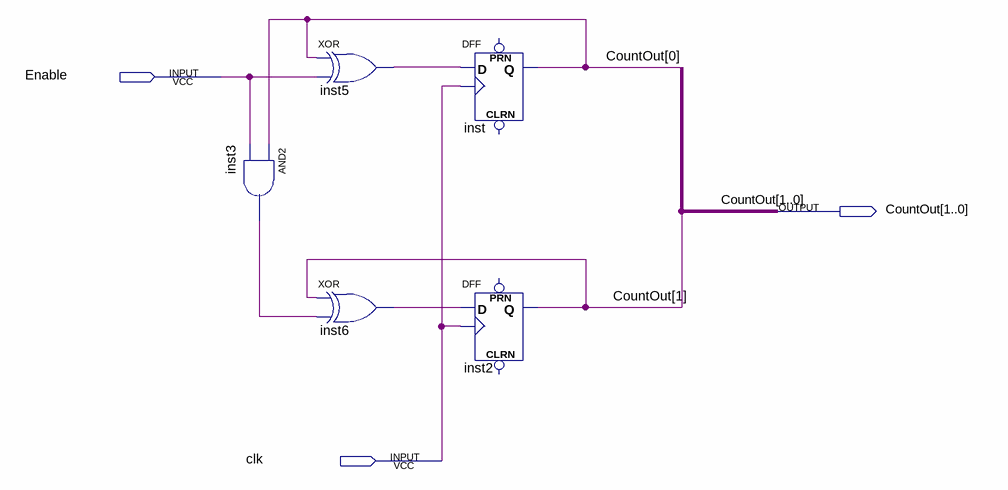
[diagram p0: schematic sheet]
// Quartus schematic TwoBitCount.bdf as structural Verilog: 5 symbols, 3 pins
module TwoBitCount (
  input  Enable,
  input  clk,
  output [1:0] CountOut
);

  wire inst3_out, inst5_out, inst6_out;

  and inst3 (inst3_out, CountOut[0], Enable);
  xor inst5 (inst5_out, CountOut[0], Enable);
  xor inst6 (inst6_out, CountOut[1], inst3_out);
  DFF inst (.CLK(clk), .D(inst5_out), .Q(CountOut[0]));  // open: CLRN, PRN
  DFF inst2 (.CLK(clk), .D(inst6_out), .Q(CountOut[1]));  // open: CLRN, PRN
endmodule
